# Altium schematic sheet rendszerterv_connectors.SchDoc
size A
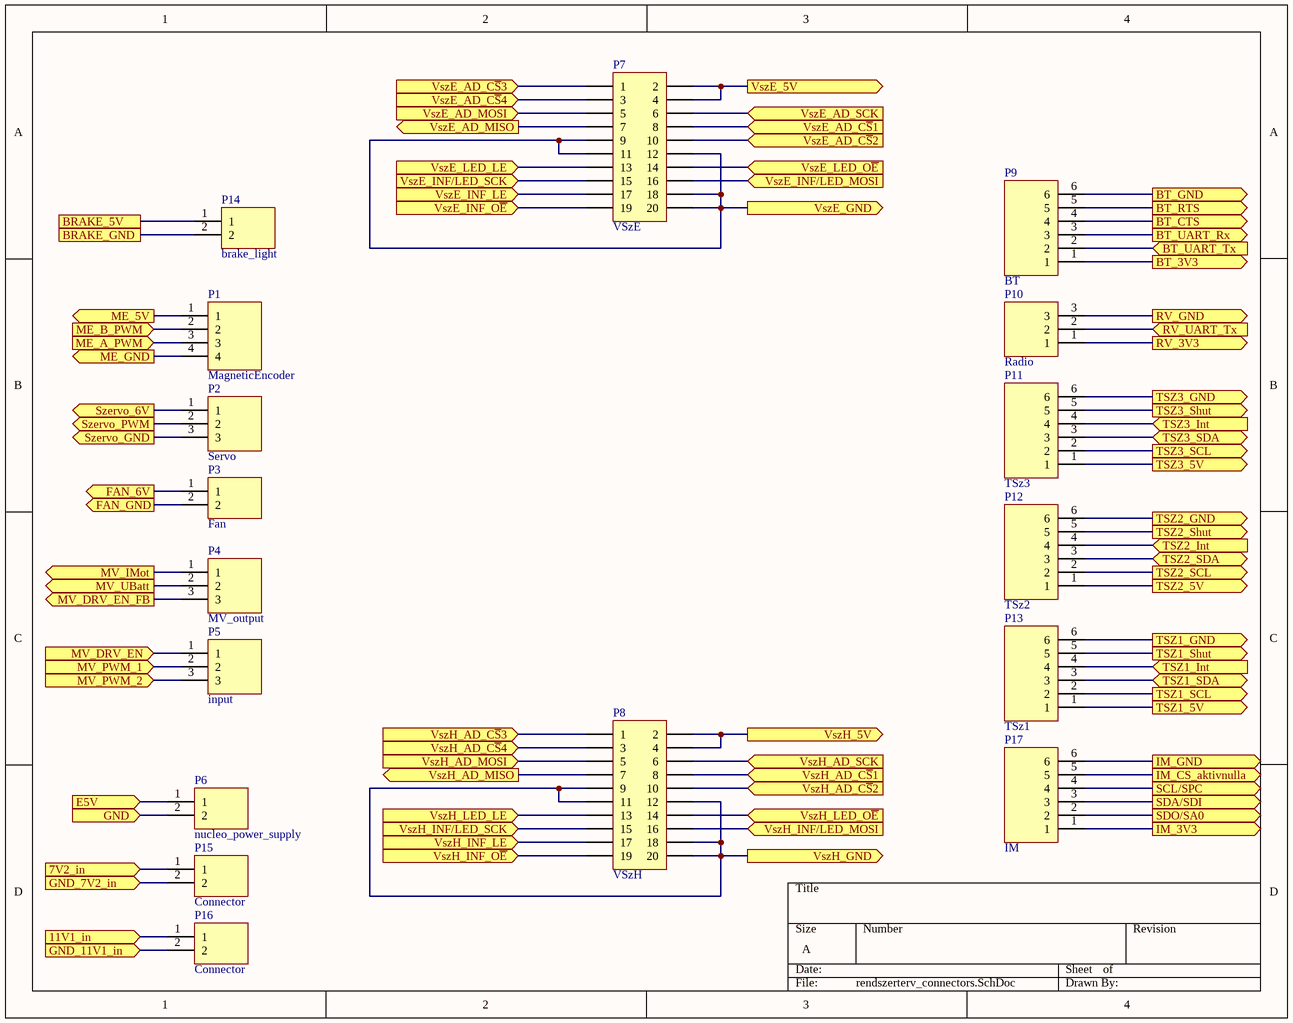
[diagram p0: rendszerterv_connectors.SchDoc]

## Parts
P1  MagneticEncoder  [FP_CONN4_2MM_180]
P2  Servo  [FP_CONN3_TUSKE_254MM]
P3  Fan  [FP_CONN2_TUSKE_254MM]
P4  MV_output  [FP_CONN3_TUSKE_254MM]
P5  input  [FP_CONN3_TUSKE_254MM]
P6  nucleo_power_supply  [FP_CONN2_TAP_254MM]
P7  VSzE  [CONNECTOR-20P]
P8  VSzH  [CONNECTOR-20P]
P9  BT  [FP_CONN6_2MM_180]
P10  Radio  [FP_CONN3_TUSKE_254MM]
P11  TSz3  [FP_CONN6_2MM_180]
P12  TSz2  [FP_CONN6_2MM_180]
P13  TSz1  [FP_CONN6_2MM_180]
P14  brake_light  [FP_CONN2_TAP_254MM]
P15  Connector  [FP_CONN2_TAP_254MM]
P16  Connector  [FP_CONN2_TAP_254MM]
P17  IM  [FP_CONN6_TAP_254MM]

## Ports
7V2_in (in), 11V1_in (in), BRAKE_5V, BRAKE_GND, BT_3V3 (out), BT_CTS (out), BT_GND (out), BT_RTS (out), BT_UART_Rx (out), BT_UART_Tx (in), E5V (in), FAN_6V (out), FAN_GND (out), GND (in), GND_7V2_in (in), GND_11V1_in (in), IM_3V3 (out), IM_CS_aktivnulla (out), IM_GND (out), ME_5V (out), ME_A_PWM (in), ME_B_PWM (in), ME_GND (out), MV_DRV_EN (in), MV_DRV_EN_FB (out), MV_IMot (out), MV_PWM_1 (in), MV_PWM_2 (in), MV_UBatt (out), RV_3V3 (out), RV_GND (out), RV_UART_Tx (in), SCL/SPC (out), SDA/SDI (out), SDO/SA0 (out), Szervo_6V (out), Szervo_GND (out), Szervo_PWM (out), TSZ1_5V (out), TSZ1_GND (out), TSZ1_Int (in), TSZ1_SCL (out), TSZ1_SDA (bidir), TSZ1_Shut (out), TSZ2_5V (out), TSZ2_GND (out), TSZ2_Int (in), TSZ2_SCL (out), TSZ2_SDA (bidir), TSZ2_Shut (out), TSZ3_5V (out), TSZ3_GND (out), TSZ3_Int (in), TSZ3_SCL (out), TSZ3_SDA (bidir), TSZ3_Shut (out), VszE_5V (out), VszE_AD_C~{S}1 (in), VszE_AD_C~{S}2 (in), VszE_AD_C~{S}3 (in), VszE_AD_C~{S}4 (in), VszE_AD_MISO (out), VszE_AD_MOSI (in), VszE_AD_SCK (in), VszE_GND (out), VszE_INF/LED_MOSI (in), VszE_INF/LED_SCK (in), VszE_INF_LE (in), VszE_INF_O~{E} (in), VszE_LED_LE (in), VszE_LED_O~{E} (in), VszH_5V (out), VszH_AD_C~{S}1 (in), VszH_AD_C~{S}2 (in), VszH_AD_C~{S}3 (in), VszH_AD_C~{S}4 (in), VszH_AD_MISO (out), VszH_AD_MOSI (in), VszH_AD_SCK (in), VszH_GND (out), VszH_INF/LED_MOSI (in), VszH_INF/LED_SCK (in), VszH_INF_LE (in), VszH_INF_O~{E} (in), VszH_LED_LE (in), VszH_LED_O~{E} (in)

## Nets
7V2_in: P15.1 ; port 7V2_in
11V1_in: P16.1 ; port 11V1_in
BRAKE_5V: P14.1 ; port BRAKE_5V
BRAKE_GND: P14.2 ; port BRAKE_GND
BT_3V3: P9.1 ; port BT_3V3
BT_CTS: P9.4 ; port BT_CTS
BT_GND: P9.6 ; port BT_GND
BT_RTS: P9.5 ; port BT_RTS
BT_UART_Rx: P9.3 ; port BT_UART_Rx
BT_UART_Tx: P9.2 ; port BT_UART_Tx
E5V: P6.1 ; port E5V
FAN_6V: P3.1 ; port FAN_6V
FAN_GND: P3.2 ; port FAN_GND
GND: P6.2 ; port GND
GND_7V2_in: P15.2 ; port GND_7V2_in
GND_11V1_in: P16.2 ; port GND_11V1_in
IM_3V3: P17.1 ; port IM_3V3
IM_CS_aktivnulla: P17.5 ; port IM_CS_aktivnulla
IM_GND: P17.6 ; port IM_GND
ME_5V: P1.1 ; port ME_5V
ME_A_PWM: P1.3 ; port ME_A_PWM
ME_B_PWM: P1.2 ; port ME_B_PWM
ME_GND: P1.4 ; port ME_GND
MV_DRV_EN: P5.1 ; port MV_DRV_EN
MV_DRV_EN_FB: P4.3 ; port MV_DRV_EN_FB
MV_IMot: P4.1 ; port MV_IMot
MV_PWM_1: P5.2 ; port MV_PWM_1
MV_PWM_2: P5.3 ; port MV_PWM_2
MV_UBatt: P4.2 ; port MV_UBatt
RV_3V3: P10.1 ; port RV_3V3
RV_GND: P10.3 ; port RV_GND
RV_UART_Tx: P10.2 ; port RV_UART_Tx
SCL/SPC: P17.4 ; port SCL/SPC
SDA/SDI: P17.3 ; port SDA/SDI
SDO/SA0: P17.2 ; port SDO/SA0
Szervo_6V: P2.1 ; port Szervo_6V
Szervo_GND: P2.3 ; port Szervo_GND
Szervo_PWM: P2.2 ; port Szervo_PWM
TSZ1_5V: P13.1 ; port TSZ1_5V
TSZ1_GND: P13.6 ; port TSZ1_GND
TSZ1_Int: P13.4 ; port TSZ1_Int
TSZ1_SCL: P13.2 ; port TSZ1_SCL
TSZ1_SDA: P13.3 ; port TSZ1_SDA
TSZ1_Shut: P13.5 ; port TSZ1_Shut
TSZ2_5V: P12.1 ; port TSZ2_5V
TSZ2_GND: P12.6 ; port TSZ2_GND
TSZ2_Int: P12.4 ; port TSZ2_Int
TSZ2_SCL: P12.2 ; port TSZ2_SCL
TSZ2_SDA: P12.3 ; port TSZ2_SDA
TSZ2_Shut: P12.5 ; port TSZ2_Shut
TSZ3_5V: P11.1 ; port TSZ3_5V
TSZ3_GND: P11.6 ; port TSZ3_GND
TSZ3_Int: P11.4 ; port TSZ3_Int
TSZ3_SCL: P11.2 ; port TSZ3_SCL
TSZ3_SDA: P11.3 ; port TSZ3_SDA
TSZ3_Shut: P11.5 ; port TSZ3_Shut
VszE_5V: P7.2 P7.4 ; port VszE_5V
VszE_AD_C~{S}1: P7.8 ; port VszE_AD_C~{S}1
VszE_AD_C~{S}2: P7.10 ; port VszE_AD_C~{S}2
VszE_AD_C~{S}3: P7.1 ; port VszE_AD_C~{S}3
VszE_AD_C~{S}4: P7.3 ; port VszE_AD_C~{S}4
VszE_AD_MISO: P7.7 ; port VszE_AD_MISO
VszE_AD_MOSI: P7.5 ; port VszE_AD_MOSI
VszE_AD_SCK: P7.6 ; port VszE_AD_SCK
VszE_GND: P7.9 P7.11 P7.12 P7.18 P7.20 ; port VszE_GND
VszE_INF/LED_MOSI: P7.16 ; port VszE_INF/LED_MOSI
VszE_INF/LED_SCK: P7.15 ; port VszE_INF/LED_SCK
VszE_INF_LE: P7.17 ; port VszE_INF_LE
VszE_INF_O~{E}: P7.19 ; port VszE_INF_O~{E}
VszE_LED_LE: P7.13 ; port VszE_LED_LE
VszE_LED_O~{E}: P7.14 ; port VszE_LED_O~{E}
VszH_5V: P8.2 P8.4 ; port VszH_5V
VszH_AD_C~{S}1: P8.8 ; port VszH_AD_C~{S}1
VszH_AD_C~{S}2: P8.10 ; port VszH_AD_C~{S}2
VszH_AD_C~{S}3: P8.1 ; port VszH_AD_C~{S}3
VszH_AD_C~{S}4: P8.3 ; port VszH_AD_C~{S}4
VszH_AD_MISO: P8.7 ; port VszH_AD_MISO
VszH_AD_MOSI: P8.5 ; port VszH_AD_MOSI
VszH_AD_SCK: P8.6 ; port VszH_AD_SCK
VszH_GND: P8.9 P8.11 P8.12 P8.18 P8.20 ; port VszH_GND
VszH_INF/LED_MOSI: P8.16 ; port VszH_INF/LED_MOSI
VszH_INF/LED_SCK: P8.15 ; port VszH_INF/LED_SCK
VszH_INF_LE: P8.17 ; port VszH_INF_LE
VszH_INF_O~{E}: P8.19 ; port VszH_INF_O~{E}
VszH_LED_LE: P8.13 ; port VszH_LED_LE
VszH_LED_O~{E}: P8.14 ; port VszH_LED_O~{E}

## Library data of the parts
P1 = Connector_4pin: 4pin Connector
P2 P4 P5 P10 = Connector_3pin: 3pin connector
P3 P6 P14-P16 = Connector_2pin: 2pin connector
P7 P8 = Connector 20: Ribbon cable connector; Reference: *; Supplier: *; Name: *
P9 P11-P13 P17 = Connector_6pin: 6pin connector